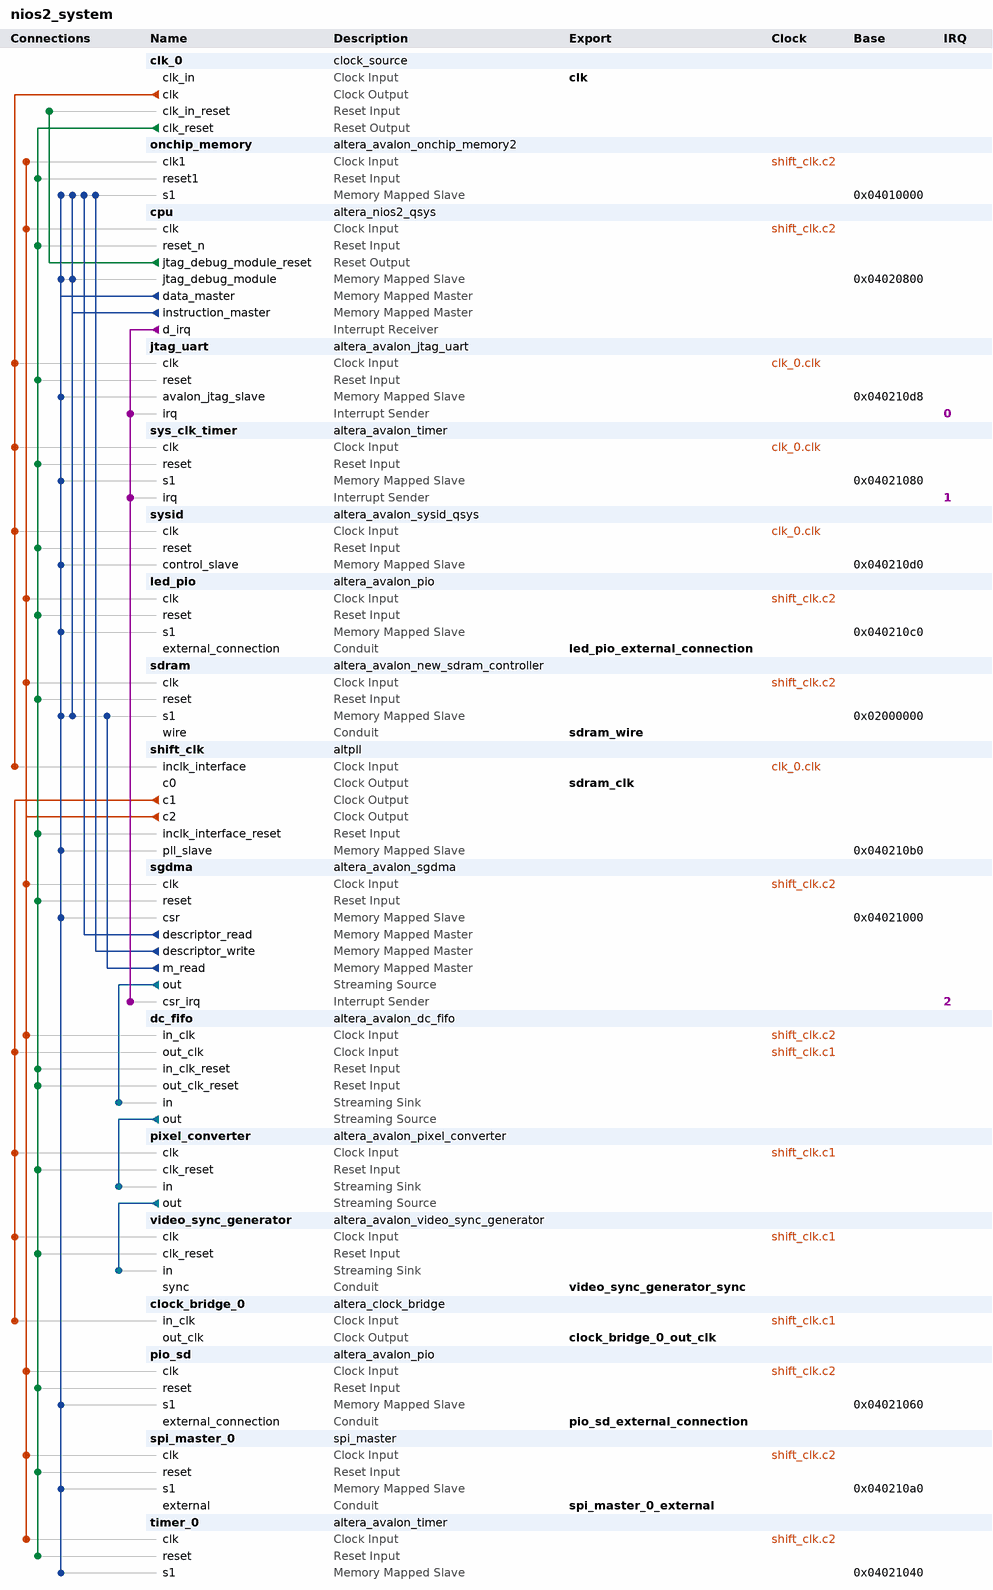
[diagram p0: system contents]
# Platform Designer (Qsys) system nios2_system, Cyclone IV E EP4CE22F17C6
# Parameters at their usual value, and those the tool derives, are not listed.
package require -exact qsys 12.1
create_system nios2_system
set_project_property DEVICE_FAMILY {Cyclone IV E}
set_project_property DEVICE EP4CE22F17C6

add_instance clk_0 clock_source 12.1
set_instance_parameter_value clk_0 clockFrequency 50000000

add_instance onchip_memory altera_avalon_onchip_memory2 12.1
set_instance_parameter_value onchip_memory dataWidth 32
set_instance_parameter_value onchip_memory dualPort false
set_instance_parameter_value onchip_memory initMemContent true
set_instance_parameter_value onchip_memory initializationFileName onchip_memory
set_instance_parameter_value onchip_memory memorySize 39000

add_instance cpu altera_nios2_qsys 12.1
set_instance_parameter_value cpu resetSlave onchip_memory.s1
set_instance_parameter_value cpu exceptionSlave onchip_memory.s1
set_instance_parameter_value cpu breakSlave cpu.jtag_debug_module
set_instance_parameter_value cpu muldiv_multiplierType NoneSmall
set_instance_parameter_value cpu impl Small
set_instance_parameter_value cpu icache_size 2048

add_instance jtag_uart altera_avalon_jtag_uart 12.1
set_instance_parameter_value jtag_uart simInteractiveOptions INTERACTIVE_ASCII_OUTPUT

add_instance sys_clk_timer altera_avalon_timer 12.1
set_instance_parameter_value sys_clk_timer period 1
set_instance_parameter_value sys_clk_timer periodUnits MSEC
set_instance_parameter_value sys_clk_timer timerPreset FULL_FEATURED

add_instance sysid altera_avalon_sysid_qsys 12.1
set_instance_parameter_value sysid id 0

add_instance led_pio altera_avalon_pio 12.1
set_instance_parameter_value led_pio direction Output
set_instance_parameter_value led_pio width 8

add_instance sdram altera_avalon_new_sdram_controller 12.1
set_instance_parameter_value sdram TAC 6.5
set_instance_parameter_value sdram TRCD 20.0
set_instance_parameter_value sdram TRP 20.0
set_instance_parameter_value sdram casLatency 2
set_instance_parameter_value sdram columnWidth 9
set_instance_parameter_value sdram dataWidth 16
set_instance_parameter_value sdram generateSimulationModel false
set_instance_parameter_value sdram initRefreshCommands 8
set_instance_parameter_value sdram model custom
set_instance_parameter_value sdram numberOfBanks 4
set_instance_parameter_value sdram numberOfChipSelects 1
set_instance_parameter_value sdram powerUpDelay 200.0
set_instance_parameter_value sdram refreshPeriod 0.75
set_instance_parameter_value sdram rowWidth 13

add_instance shift_clk altpll 12.1
set_instance_parameter_value shift_clk INCLK0_INPUT_FREQUENCY 20000
set_instance_parameter_value shift_clk CLK0_MULTIPLY_BY 2
set_instance_parameter_value shift_clk CLK1_MULTIPLY_BY 9
set_instance_parameter_value shift_clk CLK2_MULTIPLY_BY 2
set_instance_parameter_value shift_clk CLK0_DIVIDE_BY 1
set_instance_parameter_value shift_clk CLK1_DIVIDE_BY 50
set_instance_parameter_value shift_clk CLK2_DIVIDE_BY 1
set_instance_parameter_value shift_clk CLK0_PHASE_SHIFT -1500
set_instance_parameter_value shift_clk CLK1_PHASE_SHIFT 0
set_instance_parameter_value shift_clk CLK2_PHASE_SHIFT 0
set_instance_parameter_value shift_clk CLK1_DUTY_CYCLE 50
set_instance_parameter_value shift_clk CLK2_DUTY_CYCLE 50
set_instance_parameter_value shift_clk PORT_clk1 PORT_USED
set_instance_parameter_value shift_clk PORT_clk2 PORT_USED
set_instance_parameter_value shift_clk PORT_clk3 PORT_UNUSED
set_instance_parameter_value shift_clk PORT_ARESET PORT_UNUSED
set_instance_parameter_value shift_clk PORT_LOCKED PORT_UNUSED

add_instance sgdma altera_avalon_sgdma 12.1
set_instance_parameter_value sgdma enableBurstTransfers false
set_instance_parameter_value sgdma enableUnalignedTransfers false
set_instance_parameter_value sgdma readBlockDataWidth 32
set_instance_parameter_value sgdma sinkErrorWidth 0
set_instance_parameter_value sgdma sourceErrorWidth 0
set_instance_parameter_value sgdma transferMode MEMORY_TO_STREAM
set_instance_parameter_value sgdma writeBurstcountWidth 4

add_instance dc_fifo altera_avalon_dc_fifo 12.1
set_instance_parameter_value dc_fifo SYMBOLS_PER_BEAT 4
set_instance_parameter_value dc_fifo BITS_PER_SYMBOL 8
set_instance_parameter_value dc_fifo FIFO_DEPTH 2048
set_instance_parameter_value dc_fifo USE_PACKETS 1
set_instance_parameter_value dc_fifo WR_SYNC_DEPTH 2
set_instance_parameter_value dc_fifo RD_SYNC_DEPTH 2

add_instance pixel_converter altera_avalon_pixel_converter 12.1
set_instance_parameter_value pixel_converter SOURCE_SYMBOLS_PER_BEAT 1

add_instance video_sync_generator altera_avalon_video_sync_generator 12.1
set_instance_parameter_value video_sync_generator DATA_STREAM_BIT_WIDTH 24
set_instance_parameter_value video_sync_generator BEATS_PER_PIXEL 1
set_instance_parameter_value video_sync_generator NUM_COLUMNS 480
set_instance_parameter_value video_sync_generator NUM_ROWS 272
set_instance_parameter_value video_sync_generator H_BLANK_PIXELS 43
set_instance_parameter_value video_sync_generator H_FRONT_PORCH_PIXELS 2
set_instance_parameter_value video_sync_generator H_SYNC_PULSE_PIXELS 41
set_instance_parameter_value video_sync_generator H_SYNC_PULSE_POLARITY 0
set_instance_parameter_value video_sync_generator V_BLANK_LINES 12
set_instance_parameter_value video_sync_generator V_FRONT_PORCH_LINES 2
set_instance_parameter_value video_sync_generator V_SYNC_PULSE_LINES 10
set_instance_parameter_value video_sync_generator V_SYNC_PULSE_POLARITY 0
set_instance_parameter_value video_sync_generator TOTAL_HSCAN_PIXELS 525
set_instance_parameter_value video_sync_generator TOTAL_VSCAN_LINES 286

add_instance clock_bridge_0 altera_clock_bridge 12.1
set_instance_parameter_value clock_bridge_0 DERIVED_CLOCK_RATE 9000000
set_instance_parameter_value clock_bridge_0 EXPLICIT_CLOCK_RATE 0

add_instance pio_sd altera_avalon_pio 12.1
set_instance_parameter_value pio_sd bitModifyingOutReg true
set_instance_parameter_value pio_sd direction Bidir
set_instance_parameter_value pio_sd width 4

add_instance spi_master_0 spi_master 1.1

add_instance timer_0 altera_avalon_timer 12.1
set_instance_parameter_value timer_0 period 1
set_instance_parameter_value timer_0 periodUnits MSEC
set_instance_parameter_value timer_0 timerPreset CUSTOM

# connections
add_connection clk_0.clk jtag_uart.clk clock
add_connection clk_0.clk shift_clk.inclk_interface clock
add_connection clk_0.clk sys_clk_timer.clk clock
add_connection clk_0.clk sysid.clk clock
add_connection shift_clk.c1 clock_bridge_0.in_clk clock
add_connection shift_clk.c1 dc_fifo.out_clk clock
add_connection shift_clk.c1 pixel_converter.clk clock
add_connection shift_clk.c1 video_sync_generator.clk clock
add_connection shift_clk.c2 cpu.clk clock
add_connection shift_clk.c2 dc_fifo.in_clk clock
add_connection shift_clk.c2 led_pio.clk clock
add_connection shift_clk.c2 onchip_memory.clk1 clock
add_connection shift_clk.c2 pio_sd.clk clock
add_connection shift_clk.c2 sdram.clk clock
add_connection shift_clk.c2 sgdma.clk clock
add_connection shift_clk.c2 spi_master_0.clk clock
add_connection shift_clk.c2 timer_0.clk clock
add_connection clk_0.clk_reset cpu.reset_n reset
add_connection clk_0.clk_reset dc_fifo.in_clk_reset reset
add_connection clk_0.clk_reset dc_fifo.out_clk_reset reset
add_connection clk_0.clk_reset jtag_uart.reset reset
add_connection clk_0.clk_reset led_pio.reset reset
add_connection clk_0.clk_reset onchip_memory.reset1 reset
add_connection clk_0.clk_reset pio_sd.reset reset
add_connection clk_0.clk_reset pixel_converter.clk_reset reset
add_connection clk_0.clk_reset sdram.reset reset
add_connection clk_0.clk_reset sgdma.reset reset
add_connection clk_0.clk_reset shift_clk.inclk_interface_reset reset
add_connection clk_0.clk_reset spi_master_0.reset reset
add_connection clk_0.clk_reset sys_clk_timer.reset reset
add_connection clk_0.clk_reset sysid.reset reset
add_connection clk_0.clk_reset timer_0.reset reset
add_connection clk_0.clk_reset video_sync_generator.clk_reset reset
add_connection cpu.jtag_debug_module_reset clk_0.clk_in_reset reset
add_connection cpu.data_master cpu.jtag_debug_module avalon
set_connection_parameter_value cpu.data_master/cpu.jtag_debug_module baseAddress 0x04020800
add_connection cpu.data_master jtag_uart.avalon_jtag_slave avalon
set_connection_parameter_value cpu.data_master/jtag_uart.avalon_jtag_slave baseAddress 0x040210d8
add_connection cpu.data_master led_pio.s1 avalon
set_connection_parameter_value cpu.data_master/led_pio.s1 baseAddress 0x040210c0
add_connection cpu.data_master onchip_memory.s1 avalon
set_connection_parameter_value cpu.data_master/onchip_memory.s1 baseAddress 0x04010000
add_connection cpu.data_master pio_sd.s1 avalon
set_connection_parameter_value cpu.data_master/pio_sd.s1 baseAddress 0x04021060
add_connection cpu.data_master sdram.s1 avalon
set_connection_parameter_value cpu.data_master/sdram.s1 baseAddress 0x02000000
add_connection cpu.data_master sgdma.csr avalon
set_connection_parameter_value cpu.data_master/sgdma.csr arbitrationPriority 128
set_connection_parameter_value cpu.data_master/sgdma.csr baseAddress 0x04021000
add_connection cpu.data_master shift_clk.pll_slave avalon
set_connection_parameter_value cpu.data_master/shift_clk.pll_slave baseAddress 0x040210b0
add_connection cpu.data_master spi_master_0.s1 avalon
set_connection_parameter_value cpu.data_master/spi_master_0.s1 baseAddress 0x040210a0
add_connection cpu.data_master sys_clk_timer.s1 avalon
set_connection_parameter_value cpu.data_master/sys_clk_timer.s1 baseAddress 0x04021080
add_connection cpu.data_master sysid.control_slave avalon
set_connection_parameter_value cpu.data_master/sysid.control_slave baseAddress 0x040210d0
add_connection cpu.data_master timer_0.s1 avalon
set_connection_parameter_value cpu.data_master/timer_0.s1 baseAddress 0x04021040
add_connection cpu.instruction_master cpu.jtag_debug_module avalon
set_connection_parameter_value cpu.instruction_master/cpu.jtag_debug_module baseAddress 0x04020800
add_connection cpu.instruction_master onchip_memory.s1 avalon
set_connection_parameter_value cpu.instruction_master/onchip_memory.s1 baseAddress 0x04010000
add_connection cpu.instruction_master sdram.s1 avalon
set_connection_parameter_value cpu.instruction_master/sdram.s1 baseAddress 0x02000000
add_connection sgdma.descriptor_read onchip_memory.s1 avalon
set_connection_parameter_value sgdma.descriptor_read/onchip_memory.s1 baseAddress 0x04010000
add_connection sgdma.descriptor_write onchip_memory.s1 avalon
set_connection_parameter_value sgdma.descriptor_write/onchip_memory.s1 baseAddress 0x04010000
add_connection sgdma.m_read sdram.s1 avalon
set_connection_parameter_value sgdma.m_read/sdram.s1 baseAddress 0x02000000
add_connection dc_fifo.out pixel_converter.in avalon_streaming
add_connection pixel_converter.out video_sync_generator.in avalon_streaming
add_connection sgdma.out dc_fifo.in avalon_streaming
add_connection cpu.d_irq jtag_uart.irq interrupt
set_connection_parameter_value cpu.d_irq/jtag_uart.irq irqNumber 0
add_connection cpu.d_irq sgdma.csr_irq interrupt
set_connection_parameter_value cpu.d_irq/sgdma.csr_irq irqNumber 2
add_connection cpu.d_irq sys_clk_timer.irq interrupt
set_connection_parameter_value cpu.d_irq/sys_clk_timer.irq irqNumber 1

# exported interfaces
add_interface clk clock sink
set_interface_property clk EXPORT_OF clk_0.clk_in
add_interface led_pio_external_connection conduit end
set_interface_property led_pio_external_connection EXPORT_OF led_pio.external_connection
add_interface sdram_wire conduit end
set_interface_property sdram_wire EXPORT_OF sdram.wire
add_interface video_sync_generator_sync conduit end
set_interface_property video_sync_generator_sync EXPORT_OF video_sync_generator.sync
add_interface clock_bridge_0_out_clk clock source
set_interface_property clock_bridge_0_out_clk EXPORT_OF clock_bridge_0.out_clk
add_interface sdram_clk clock source
set_interface_property sdram_clk EXPORT_OF shift_clk.c0
add_interface pio_sd_external_connection conduit end
set_interface_property pio_sd_external_connection EXPORT_OF pio_sd.external_connection
add_interface spi_master_0_external conduit end
set_interface_property spi_master_0_external EXPORT_OF spi_master_0.external

save_system nios2_system.qsys
